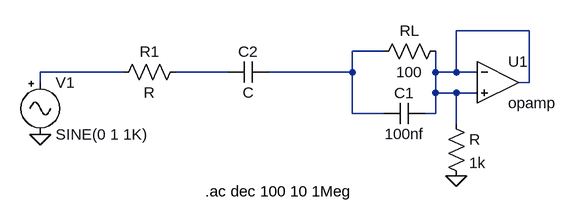
[diagram p0: schematic Draft1.asc]
Draft1.asc, the LTspice schematic file:
Version 4
SHEET 1 880 680
WIRE 192 80 80 80
WIRE -32 112 -80 112
WIRE -432 144 -560 144
WIRE -272 144 -352 144
WIRE -80 144 -80 112
WIRE -80 144 -208 144
WIRE 48 144 48 112
WIRE 80 144 80 80
WIRE 80 144 48 144
WIRE 112 144 80 144
WIRE -560 160 -560 144
WIRE 192 160 192 80
WIRE 192 160 176 160
WIRE 48 176 48 144
WIRE 80 176 48 176
WIRE 112 176 80 176
WIRE -80 208 -80 144
WIRE -32 208 -80 208
WIRE 48 208 48 176
WIRE 48 208 32 208
WIRE 80 224 80 176
FLAG 80 304 0
FLAG -560 240 0
SYMBOL Opamps\\opamp 144 96 R0
SYMATTR InstName U1
SYMBOL res 64 96 R90
WINDOW 0 0 56 VBottom 2
WINDOW 3 32 56 VTop 2
SYMATTR InstName RL
SYMATTR Value 100
SYMBOL res 64 208 R0
SYMATTR InstName R
SYMATTR Value 1k
SYMBOL cap 32 192 R90
WINDOW 0 0 32 VBottom 2
WINDOW 3 32 32 VTop 2
SYMATTR InstName C1
SYMATTR Value 100nf
SYMBOL res -336 128 R90
WINDOW 0 0 56 VBottom 2
WINDOW 3 32 56 VTop 2
SYMATTR InstName R1
SYMBOL cap -208 128 R90
WINDOW 0 0 32 VBottom 2
WINDOW 3 32 32 VTop 2
SYMATTR InstName C2
SYMBOL Misc\\signal -560 144 R0
SYMATTR InstName V1
TEXT -306 328 Left 2 !.ac dec 100 10 1Meg

The netlist it stands for:
* Draft1.asc
XU1 N001 N001 N001 opamp Aol=100K GBW=10Meg  ; pins invin noninvin out
RL N001 N002 100
R N001 0 1k
C1 N001 N002 100nf
R1 N004 N003 R
C2 N002 N004 C
V1 N003 0 SINE(0 1 1K)
.ac dec 100 10 1Meg
.backanno
.end